# Altium schematic sheet motor_controller.SchDoc: Brushless Motor Controller
size Letter
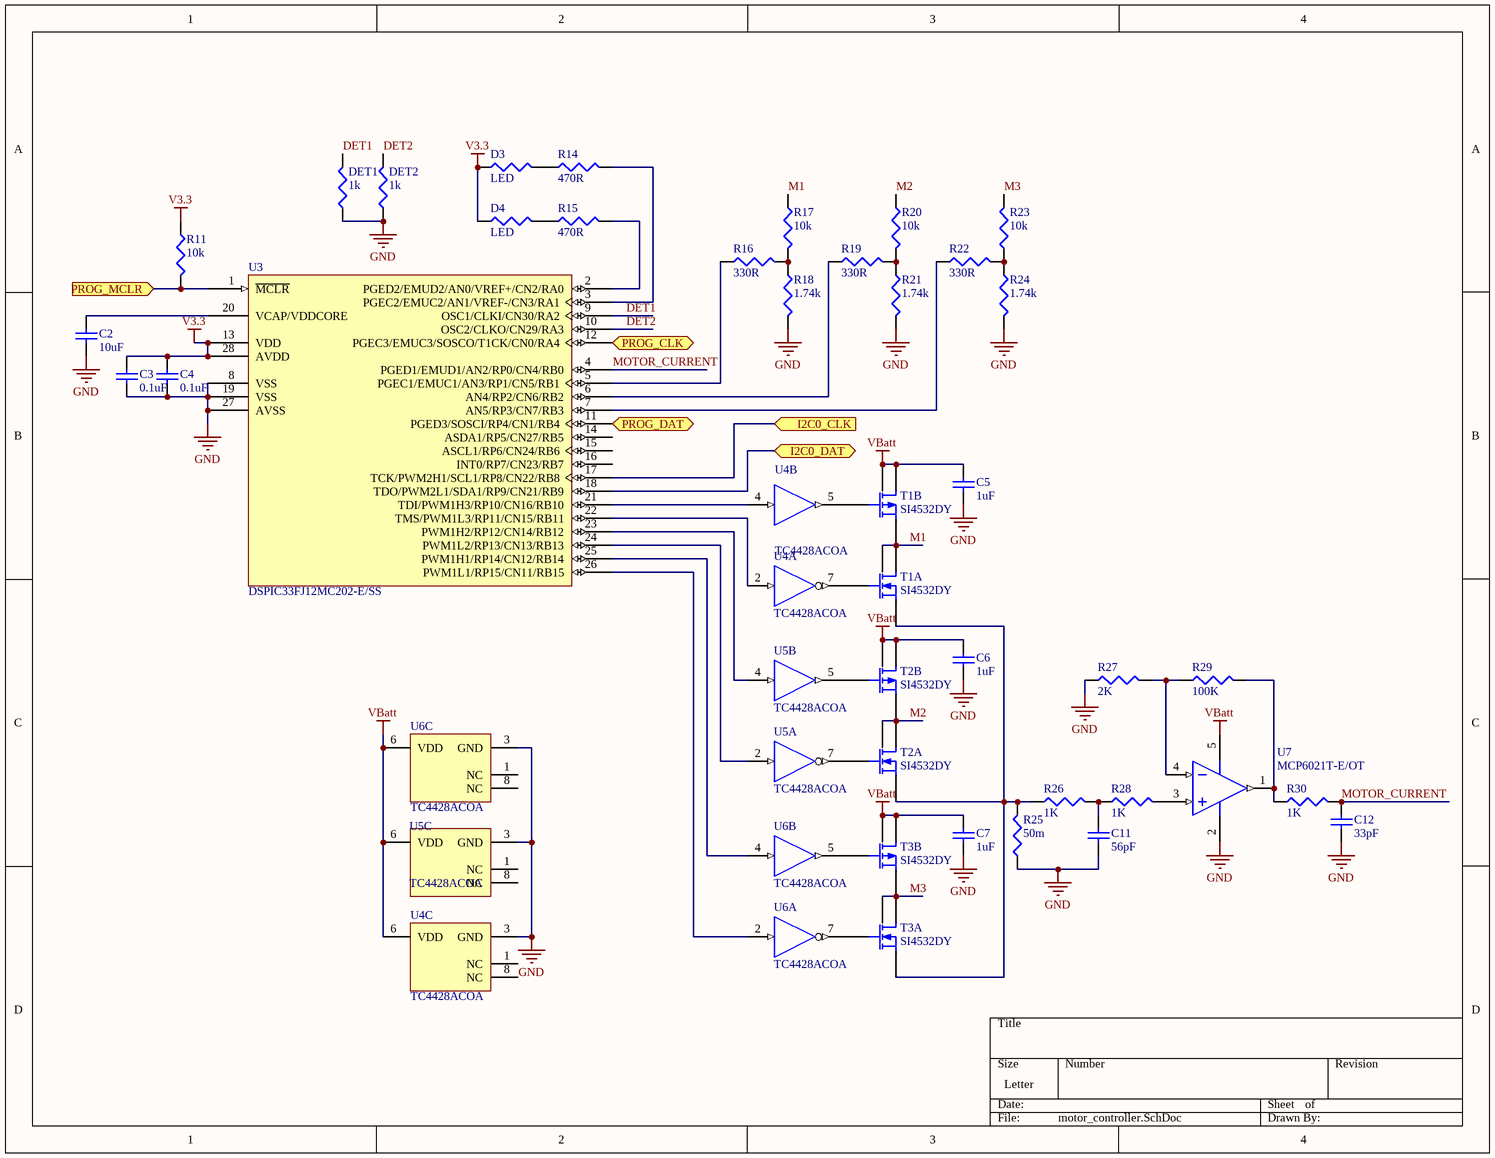
[diagram p0: motor_controller.SchDoc]

## Parts
C2  10uF  [1608[0603]]
C3  0.1uF  [1608[0603]]
C4  0.1uF  [1608[0603]]
C5  1uF  [1608[0603]]
C6  1uF  [1608[0603]]
C7  1uF  [1608[0603]]
C11  56pF  [1608[0603]]
C12  33pF  [1608[0603]]
D3  LED  [J1-0603]
D4  LED  [J1-0603]
DET1  1k  [J1-0603]
DET2  1k  [J1-0603]
R11  10k  [J1-0603]
R14  470R  [J1-0603]
R15  470R  [J1-0603]
R16  330R  [J1-0603]
R17  10k  [J1-0603]
R18  1.74k  [J1-0603]
R19  330R  [J1-0603]
R20  10k  [J1-0603]
R21  1.74k  [J1-0603]
R22  330R  [J1-0603]
R23  10k  [J1-0603]
R24  1.74k  [J1-0603]
R25  50m  [14-1210]
R26  1K  [J1-0603]
R27  2K  [J1-0603]
R28  1K  [J1-0603]
R29  100K  [J1-0603]
R30  1K  [J1-0603]
T1  SI4532DY  [SOIC127P600-8L]  (parts A,B of 2)
T2  SI4532DY  [SOIC127P600-8L]  (parts A,B of 2)
T3  SI4532DY  [SOIC127P600-8L]  (parts A,B of 2)
U3  DSPIC33FJ12MC202-E/SS  [SSOP-SS28_N]
U4  TC4428ACOA  [SOIC-OA8_N]  (parts A,B,C of 3)
U5  TC4428ACOA  [SOIC-OA8_N]  (parts A,B,C of 3)
U6  TC4428ACOA  [SOIC-OA8_N]  (parts A,B,C of 3)
U7  MCP6021T-E/OT  [SOT-23-OT5_N]

## Ports
I2C0_CLK (in), I2C0_DAT (bidir), PROG_CLK (bidir), PROG_DAT (bidir), PROG_MCLR (in)

## Nets
GND: C2.1 C3.1 C4.1 C5.1 C6.1 C7.1 C11.1 C12.1 DET1.1 DET2.1 R18.2 R21.2 R24.2 R25.1 R27.1 U3.8(VSS) U3.19(VSS) U3.27(AVSS) U4.3(GND) U5.3(GND) U6.3(GND) U7.2(VSS)
V3.3: C3.2 C4.2 D3.1 D4.1 R11.1 U3.13(VDD) U3.28(AVDD)
VBatt: C5.2 C6.2 C7.2 T1.5(D2) T1.6(D2) T2.5(D2) T2.6(D2) T3.5(D2) T3.6(D2) U4.6(VDD) U5.6(VDD) U6.6(VDD) U7.5(VDD)
DET1: DET1.2 U3.9(OSC1/CLKI/CN30/RA2)
DET2: DET2.2 U3.10(OSC2/CLKO/CN29/RA3)
I2C0_CLK: U3.17(TCK/PWM2H1/SCL1/RP8/CN22/RB8) ; port I2C0_CLK
I2C0_DAT: U3.18(TDO/PWM2L1/SDA1/RP9/CN21/RB9) ; port I2C0_DAT
M1: R17.1 T1.3(S2) T1.7(D1) T1.8(D1)
M2: R20.1 T2.3(S2) T2.7(D1) T2.8(D1)
M3: R23.2 T3.3(S2) T3.7(D1) T3.8(D1)
MOTOR_CURRENT: C12.2 R30.2 U3.4(PGED1/EMUD1/AN2/RP0/CN4/RB0)
PROG_CLK: U3.12(PGEC3/EMUC3/SOSCO/T1CK/CN0/RA4) ; port PROG_CLK
PROG_DAT: U3.11(PGED3/SOSCI/RP4/CN1/RB4) ; port PROG_DAT
PROG_MCLR: R11.2 U3.1(~{MCLR}) ; port PROG_MCLR
NetC2_2: C2.2 U3.20(VCAP/VDDCORE)
NetC11_2: C11.2 R26.2 R28.1
NetD3_2: D3.2 R14.1
NetD4_2: D4.2 R15.1
NetR14_2: R14.2 U3.3(PGEC2/EMUC2/AN1/VREF-/CN3/RA1)
NetR15_2: R15.2 U3.2(PGED2/EMUD2/AN0/VREF+/CN2/RA0)
NetR16_1: R16.1 U3.5(PGEC1/EMUC1/AN3/RP1/CN5/RB1)
NetR16_2: R16.2 R17.2 R18.1
NetR19_1: R19.1 U3.6(AN4/RP2/CN6/RB2)
NetR19_2: R19.2 R20.2 R21.1
NetR22_1: R22.1 U3.7(AN5/RP3/CN7/RB3)
NetR22_2: R22.2 R23.1 R24.1
NetR25_2: R25.2 R26.1 T1.1(S1) T2.1(S1) T3.1(S1)
NetR27_2: R27.2 R29.1 U7.4(VIN-)
NetR28_2: R28.2 U7.3(VIN+)
NetR29_2: R29.2 R30.1 U7.1(VOUT)
NetT1_2: T1.2(G1) U4.7(~{OUTA})
NetT1_4: T1.4(G2) U4.5(OUTB)
NetT2_2: T2.2(G1) U5.7(~{OUTA})
NetT2_4: T2.4(G2) U5.5(OUTB)
NetT3_2: T3.2(G1) U6.7(~{OUTA})
NetT3_4: T3.4(G2) U6.5(OUTB)
NetU3_21: U3.21(TDI/PWM1H3/RP10/CN16/RB10) U4.4(INB)
NetU3_22: U3.22(TMS/PWM1L3/RP11/CN15/RB11) U4.2(INA)
NetU3_23: U3.23(PWM1H2/RP12/CN14/RB12) U5.4(INB)
NetU3_24: U3.24(PWM1L2/RP13/CN13/RB13) U5.2(INA)
NetU3_25: U3.25(PWM1H1/RP14/CN12/RB14) U6.4(INB)
NetU3_26: U3.26(PWM1L1/RP15/CN11/RB15) U6.2(INA)

Not connected (* = marked no-connect by the designer): U3 14(ASDA1/RP5/CN27/RB5) 15(ASCL1/RP6/CN24/RB6) 16(INT0/RP7/CN23/RB7); U4 1(NC) 8(NC); U5 1(NC) 8(NC); U6 1(NC) 8(NC)

## Library data of the parts
C2-C7 C11 C12 = Cap Semi: Capacitor (Semiconductor SIM Model); Value: 100pF; Published: 8-Jun-2000; LatestRevisionDate: 29-May-2009; LatestRevisionNote: IPC-7351 Footprint Added.; PackageReference: C1206; Publisher: Altium Limited; PackageDescription: Chip Capacitor
D3 D4 R11 R14-R25 R27 R29 = Res3: Resistor; Value: 1K; Published: 8-Jun-2000; LatestRevisionDate: 29-May-2009; LatestRevisionNote: IPC-7351 Footprint Added.; PackageReference: J1-0603; Publisher: Altium Limited; PackageDescription: Chip Resistor
DET1 DET2 R26 R28 R30 = Res3: Resistor; Published: 8-Jun-2000; LatestRevisionDate: 29-May-2009; LatestRevisionNote: IPC-7351 Footprint Added.; PackageReference: J1-0603; Publisher: Altium Limited; PackageDescription: Chip Resistor; Value: 1K
U3 = DSPIC33FJ12MC202-E/SS: High-Performance 16-bit Digital Signal Controller, 12 KB Flash, 1 KB RAM, 28-Pin SSOP, Extended High Temperature; DatasheetVersion: revD, Jun-2009; PackageVersion: revBB, Aug-2009; PackageReference: SSOP-SS28; PackageDescription: 28-Lead Plastic Shrink Small Outline (SS) - 5.3mm Body [SSOP]; Code_JEDEC: MS-150; ComponentLink1Description: Manufacturer URL; ComponentLink1URL: http://www.microchip.com/; ComponentLink2Description: Datasheet; ComponentLink2URL: http://ww1.microchip.com/downloads/en/DeviceDoc/70265D.pdf; ComponentLink3Description: Package Specification; ComponentLink3URL: http://www.microchip.com/stellent/groups/techpub_sg/documents/packagingspec/en012702.pdf
U4-U6 = TC4428ACOA: 1.5A Dual High-Speed Power MOSFET Driver, Complementary, Commercial Temperature; DatasheetVersion: revF, Jan-2006; PackageVersion: revBB, Aug-2009; PackageReference: SOIC-OA8; PackageDescription: 8-Lead Plastic Small Outline (OA) - Narrow, 3.90mm Body [SOIC]; Code_IPC: SOIC127P600-8; ComponentLink1Description: Manufacturer URL; ComponentLink1URL: http://www.microchip.com/; ComponentLink2Description: Datasheet; ComponentLink2URL: http://ww1.microchip.com/downloads/en/DeviceDoc/21423F.pdf; ComponentLink3Description: Package Specification; ComponentLink3URL: http://www.microchip.com/stellent/groups/techpub_sg/documents/packagingspec/en012702.pdf
U7 = MCP6021T-E/OT: Rail-to-Rail Input/Output, 10 MHz Operational Amplifier, 5-Pin SOT-23, Extended Temperature, Tape and Reel; DatasheetVersion: revD, Feb-2009; PackageVersion: revBB, Aug-2009; PackageReference: SOT-23-OT5; PackageDescription: 5-Lead Plastic Small Outline Transistor (OT) [SOT-23]; Code_IPC: SOT23-5; ComponentLink1Description: Manufacturer URL; ComponentLink1URL: http://www.microchip.com/; ComponentLink2Description: Datasheet; ComponentLink2URL: http://ww1.microchip.com/downloads/en/DeviceDoc/21685d.pdf; ComponentLink3Description: Package Specification; ComponentLink3URL: http://www.microchip.com/stellent/groups/techpub_sg/documents/packagingspec/en012702.pdf